# Altium schematic sheet Trace.SchDoc: MIŠKO 3.0
size A4; Date: 19.9.2021; Author: AMADEJ PAPEŽ; SheetNumber: 13; SheetTotal: 13; SheetTitle: TRACE; Version: V1.1
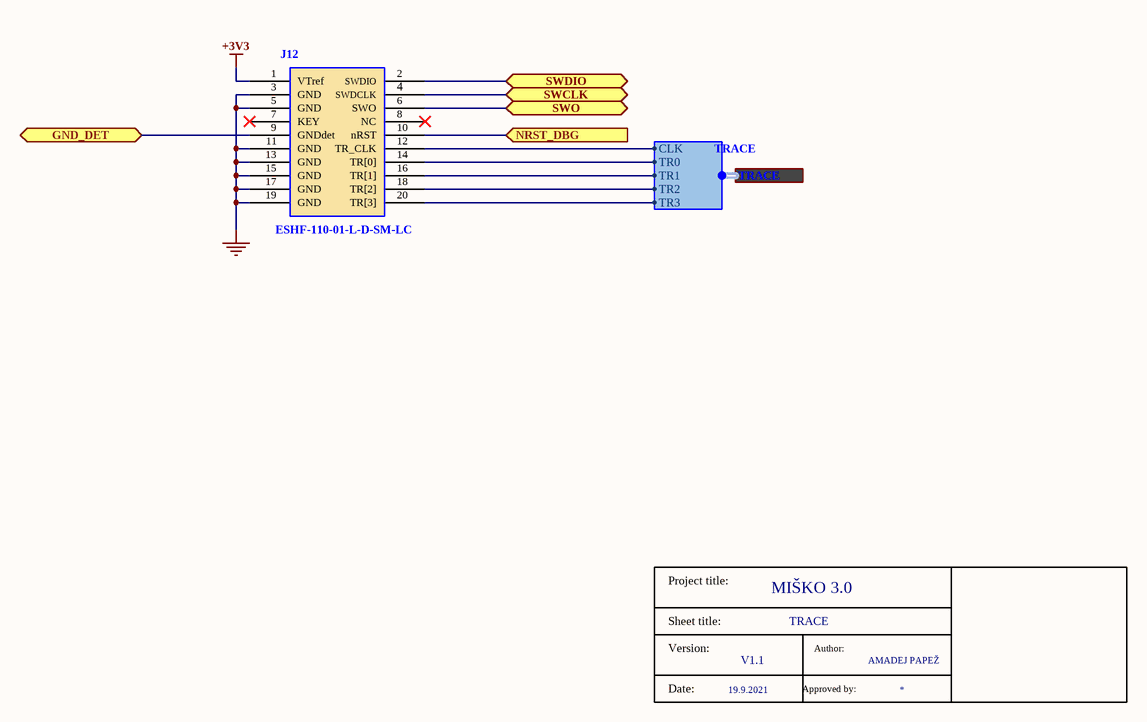
[diagram p0: Trace.SchDoc]

## Parts
J12  ESHF-110-01-L-D-SM-LC  [ESHF-110-01-L-D-SM-LC]
T13  (no value)

## Ports
GND_DET (bidir), NRST_DBG (in), SWCLK (bidir), SWDIO (bidir), SWO (bidir), TRACE (harness TRACE)

## Harnesses
TRACE: CLK, TR0, TR1, TR2, TR3

## Nets
+3V3: J12.1(VTref)
GND: J12.3(GND) J12.5(GND) J12.11(GND) J12.13(GND) J12.15(GND) J12.17(GND) J12.19(GND)
GND_DET: J12.9(GNDdet) ; port GND_DET
NRST_DBG: J12.10(nRST) ; port NRST_DBG
SWCLK: J12.4(SWDCLK) ; port SWCLK
SWDIO: J12.2(SWDIO) ; port SWDIO
SWO: J12.6(SWO) ; port SWO
NetJ12_12: J12.12(TR_CLK) ; port TRACE.CLK
NetJ12_14: J12.14(TR[0]) ; port TRACE.TR0
NetJ12_16: J12.16(TR[1]) ; port TRACE.TR1
NetJ12_18: J12.18(TR[2]) ; port TRACE.TR2
NetJ12_20: J12.20(TR[3]) ; port TRACE.TR3

Not connected (* = marked no-connect by the designer): J12 7(KEY)* 8(NC)*

## Notes on the sheet
- (in symbol Title block) Project title:; Sheet title:; Version:; Author:; Date:; Approved by:

## Library data of the parts
J12 = ESHF-110-01-L-D-SM-LC: Trace/JTAG/SW connector; Code: QYS50-20-M-SMD-LC
T13 = Title block